# Altium schematic sheet POWER.SchDoc
size B; SheetNumber: 2; SheetTotal: 4
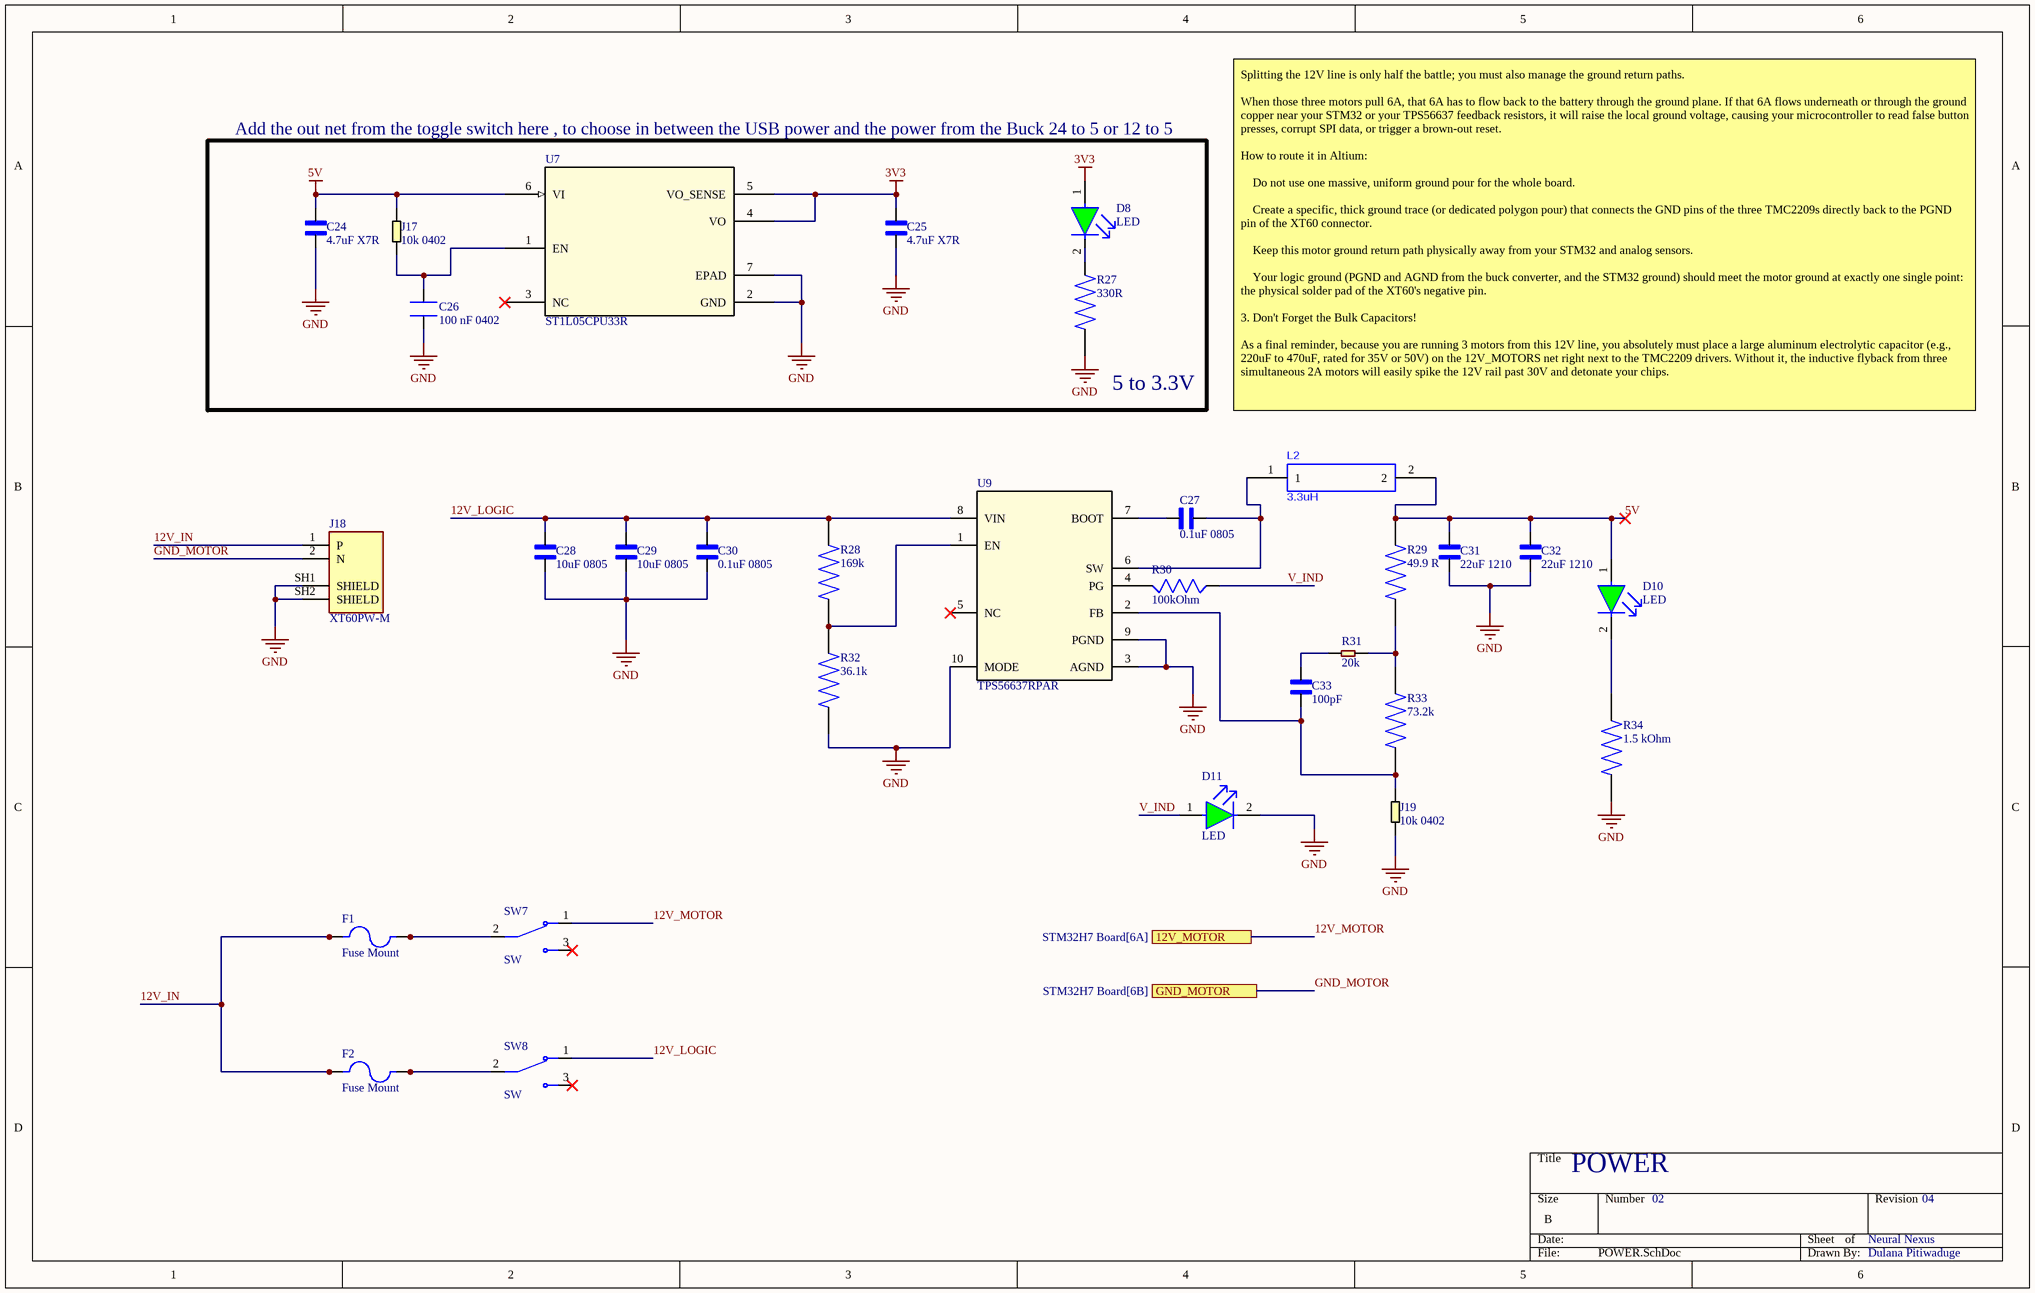
[diagram p0: POWER.SchDoc]

## Parts
C24  4.7uF X7R  [CAPC2012X145N]
C25  4.7uF X7R  [CAPC2012X145N]
C26  100 nF 0402  [CAPC1005X55N]
C27  0.1uF 0805  [CAPC2012X95N]
C28  10uF 0805  [CAPC2012X145N]
C29  10uF 0805  [CAPC2012X145N]
C30  0.1uF 0805  [CAPC2012X95N]
C31  22uF 1210  [CAPC3225X270N]
C32  22uF 1210  [CAPC3225X270N]
C33  100pF  [CAPC1005X55N]
D8  LED  [FP-SML-LX0805SRC-TR-MFG]
D10  LED  [FP-SML-LX0805SRC-TR-MFG]
D11  LED  [FP-SML-LX0805SRC-TR-MFG]
F1  Fuse Mount  [FUSE_3568]
F2  Fuse Mount  [FUSE_3568]
J17  10k 0402  [RESC1005X40N]
J18  XT60PW-M  [AMASS_XT60PW-M]
J19  10k 0402  [RESC1005X40N]
L2  3.3uH  [IND-SMD_L4.0-W4.0 - duplicate]
R27  330R  [RESC1005X40N]
R28  169k  [RESC1508X55N]
R29  49.9 R  [RESC1005X40N]
R30  100kOhm  [RESC1005X40]
R31  20k  [R0603]
R32  36.1k  [RESC1608X55N]
R33  73.2k  [RESC1005X35N]
R34  1.5 kOhm  [RESC1005X40N]
SW7  SW  [SW_100SP3T1B1M2QE]
SW8  SW  [SW_100SP3T1B1M2QE]
U7  ST1L05CPU33R  [DFN6_3X3_STM]
U9  TPS56637RPAR  [CONV_TPS56637RPAR]

## Blocks framed on the sheet
5 to 3.3V: C24-C26 D8 J17 R27 U7

## Ports
12V_MOTOR (see STM32H7 Board[6A]), GND_MOTOR (see STM32H7 Board[6B])

## Nets
3V3: C25.2 D8.1(A) U7.4(VO) U7.5(VO_SENSE)
5V: C24.2 C31.2 C32.2 D10.1(A) J17.2 L2.2 R29.2 U7.6(VI)
GND: C24.1 C25.1 C26.1 C28.1 C29.1 C30.1 C31.1 C32.1 D11.2(C) J18.SH1(SHIELD) J18.SH2(SHIELD) J19.1 R27.1 R32.1 R34.1 U7.2(GND) U7.7(EPAD) U9.3(AGND) U9.9(PGND) U9.10(MODE)
12V_IN: F1.1 F1.3 F2.1 F2.3 J18.1(P)
12V_LOGIC: C28.2 C29.2 C30.2 R28.2 SW8.1 U9.8(VIN)
12V_MOTOR: SW7.1 ; port 12V_MOTOR
GND_MOTOR: J18.2(N) ; port GND_MOTOR
V_IND: D11.1(A) R30.2
NetC26_2: C26.2 J17.1 U7.1(EN)
NetC27_1: C27.1 L2.1 U9.6(SW)
NetC27_2: C27.2 U9.7(BOOT)
NetC33_1: C33.1 J19.2 R33.1 U9.2(FB)
NetC33_2: C33.2 R31.1
NetD8_2: D8.2(C) R27.2
NetD10_2: D10.2(C) R34.2
NetF1_2: F1.2 F1.4 SW7.2
NetF2_2: F2.2 F2.4 SW8.2
NetR28_1: R28.1 R32.2 U9.1(EN)
NetR29_1: R29.1 R31.2 R33.2
NetR30_1: R30.1 U9.4(PG)

Not connected (* = marked no-connect by the designer): SW7 3*; SW8 3*; U7 3(NC)*; U9 5(NC)*

## Notes on the sheet
- Add the out net from the toggle switch here , to choose in between the USB power and the power from the Buck 24 to 5 or 12 to 5
- Splitting the 12V line is only half the battle; you must also manage the ground return paths.
  When those three motors pull 6A, that 6A has to flow back to the battery through the ground plane. If that 6A flows underneath or through the ground copper near your STM32 or your TPS56637 feedback resistors, it will raise the local ground voltage, causing your microcontroller to read false button presses, corrupt SPI data, or trigger a brown-out reset.
  How to route it in Altium:
  Do not use one massive, uniform ground pour for the whole board.
  Create a specific, thick ground trace (or dedicated polygon pour) that connects the GND pins of the three TMC2209s directly back to the PGND pin of the XT60 connector.
  Keep this motor ground return path physically away from your STM32 and analog sensors.
  Your logic ground (PGND and AGND from the buck converter, and the STM32 ground) should meet the motor ground at exactly one single point: the physical solder pad of the XT60's negative pin.
  3. Don't Forget the Bulk Capacitors!
  As a final reminder, because you are running 3 motors from this 12V line, you absolutely must place a large aluminum electrolytic capacitor (e.g., 220uF to 470uF, rated for 35V or 50V) on the 12V_MOTORS net right next to the TMC2209 drivers. Without it, the inductive flyback from three simultaneous 2A motors will easily spike the 12V rail past 30V and detonate your chips.
- POWER
- 02
- Neural Nexus
- 04
- Dulana Pitiwaduge

## Library data of the parts
C24 C25 = C2012X7R1A475K125AC: C Series 0805 4.7 uF 10 V Â±10% Tolerance X7R SMT Multilayer Ceramic Capacitor; MF: TDK; Check_prices: https://www.snapeda.com/parts/C2012X7R1A475K125AC/TDK-Lambda+Americas+Inc/view-part/?ref=eda; Purchase-URL: https://pricing.snapeda.com/search/part/C2012X7R1A475K125AC/?ref=eda; Value: *; Availability: In Stock; Price: None; Package: 2012 TDK; MP: C2012X7R1A475K125AC; SnapEDA_Link: https://www.snapeda.com/parts/C2012X7R1A475K125AC/TDK-Lambda+Americas+Inc/view-part/?ref=snap
C26 = CL05B104KP5NNNC: 0.1 ÂµF Â±10% 10V Ceramic Capacitor X7R 0402 (1005 Metric); MF: Samsung Electro-Mechanics; SnapEDA_Link: https://www.snapeda.com/parts/CL05B104KP5NNNC/Samsung/view-part/?ref=snap; Package: SMD-2 Samsung; Value: *; MP: CL05B104KP5NNNC; Check_prices: https://www.snapeda.com/parts/CL05B104KP5NNNC/Samsung/view-part/?ref=eda
C27 C30 = CL21B104KBCNNNC: 0.1 ÂµF Â±10% 50V Ceramic Capacitor X7R 0805 (2012 Metric); MF: Samsung Electro-Mechanics; SnapEDA_Link: https://www.snapeda.com/parts/CL21B104KBCNNNC/Samsung/view-part/?ref=snap; Package: SMD-2 Samsung; Value: *; MP: CL21B104KBCNNNC; Check_prices: https://www.snapeda.com/parts/CL21B104KBCNNNC/Samsung/view-part/?ref=eda
C28 C29 = GRM21BZ71E106KE15L: SMD capacitor X7R(MURATA) with capacitance 10uF Tol.10%. Rated voltage 25Vdc 125C; SnapEDA_Link: https://www.snapeda.com/parts/GRM21BZ71E106KE15L/Murata/view-part/?ref=snap; Package: 2012 Murata; Value: *; MF: Murata; MP: GRM21BZ71E106KE15L; Check_prices: https://www.snapeda.com/parts/GRM21BZ71E106KE15L/Murata/view-part/?ref=eda
C31 C32 = GRM32ER71E226KE15L: SMD capacitor X7R(EIA) with capacitance 22uF Tol.10%. Rated voltage 25Vdc 125C; MF: Murata Electronics; SnapEDA_Link: https://www.snapeda.com/parts/GRM32ER71E226KE15L/Murata+Electronics+North+America/view-part/?ref=snap; Package: 3225 Murata; Value: *; MP: GRM32ER71E226KE15L; Check_prices: https://www.snapeda.com/parts/GRM32ER71E226KE15L/Murata+Electronics+North+America/view-part/?ref=eda
C33 = CL05C101JB5NNNC: 100 pF Â±5% 50V Ceramic Capacitor C0G, NP0 0402 (1005 Metric); MF: Samsung Electro-Mechanics; SnapEDA_Link: https://www.snapeda.com/parts/CL05C101JB5NNNC/Samsung/view-part/?ref=snap; Package: SMD-2 Samsung; Value: *; MP: CL05C101JB5NNNC; Check_prices: https://www.snapeda.com/parts/CL05C101JB5NNNC/Samsung/view-part/?ref=eda
D8 D10 D11 = RED GREEN: LED RED CLEAR SMD; TRONIC part No: LE0011
F1 F2 = Fuse Mount: Auto Fuse Holder, Mini, THM, 1 Fuse, 30Amp, Hi-Temp Nylon, UL94V-0, Brass/Tin | Keystone Electronics 3568; MP: 3568; SnapEDA_Link: https://www.snapeda.com/parts/3568/Keystone/view-part/?ref=snap; Package: NON STANDARD Keystone; Value: *; MF: Keystone Electronics; Check_prices: https://www.snapeda.com/parts/3568/Keystone/view-part/?ref=eda
J17 J19 = SMD-RES-10K-5%-1/(0402): 301010004; MF: {'manufacturer': u'YAGEO'}; MP: RC0402JR-0710KL; Package: None; Price: None; Value: *; Availability: Unavailable
J18 = XT60PW-M: Socket, DC supply, male, PIN: 2; MF: AMASS; SnapEDA_Link: https://www.snapeda.com/parts/XT60PW-M/AMASS/view-part/?ref=snap; Package: Package; MP: XT60PW-M; Check_prices: https://www.snapeda.com/parts/XT60PW-M/AMASS/view-part/?ref=eda; LCSC Part Number: C98732
L2 = 33uH: FHD4020S-3R3MT; TRONIC Part No: IN0008
R27 = RC0402FR-07330RL: 330 Ohms Â±1% 0.063W, 1/16W Chip Resistor 0402 (1005 Metric) Moisture Resistant Thick Film; MF: Yageo; SnapEDA_Link: https://www.snapeda.com/parts/RC0402FR-07330RL/Yageo/view-part/?ref=snap; Package: 1005 Panasonic Electronic Components; Value: *; MP: RC0402FR-07330RL; Check_prices: https://www.snapeda.com/parts/RC0402FR-07330RL/Yageo/view-part/?ref=eda
R28 = RMCF0603FT169K: 169 kOhms Â±1% 0.1W, 1/10W Chip Resistor 0603 (1608 Metric) Automotive AEC-Q200 Thick Film; MF: Stackpole Electronics Inc; SnapEDA_Link: https://www.snapeda.com/parts/RMCF0603FT169K/Stackpole+Electronics/view-part/?ref=snap; Package: 1508 Stackpole; Value: *; MP: RMCF0603FT169K; Check_prices: https://www.snapeda.com/parts/RMCF0603FT169K/Stackpole+Electronics/view-part/?ref=eda
R29 = CRCW040249R9FKED: Resistor,Thick Film,49.9 Ohms,0.063 W,1%,SMT,0402,TCR 37 ppm/DegC,Cut Tape | Vishay Dale CRCW040249R9FKED; SnapEDA_Link: https://www.snapeda.com/parts/CRCW040249R9FKED/Vishay+Dale/view-part/?ref=snap; Package: 1005 Panasonic Electronic Components; Value: *; MF: Vishay Dale; MP: CRCW040249R9FKED; Check_prices: https://www.snapeda.com/parts/CRCW040249R9FKED/Vishay+Dale/view-part/?ref=eda
R30 = RC0402FR-07100KL: 100 kOhms Â±1% 0.063W, 1/16W Chip Resistor 0402 (1005 Metric) Moisture Resistant Thick Film; MF: Yageo; SnapEDA_Link: https://www.snapeda.com/parts/RC0402FR-07100KL/Yageo/view-part/?ref=snap; Package: 0402 Yageo; Value: *; MP: RC0402FR-07100KL; Check_prices: https://www.snapeda.com/parts/RC0402FR-07100KL/Yageo/view-part/?ref=eda
R31 = SMD-RES-20K-1%-1/10W(0603): 20 kOhms Â±1% 0.1W, 1/10W Chip Resistor 0603 (1608 Metric) Moisture Resistant Thick Film; MF: Yageo; MP: RC0603FR-0720KL; SnapEDA_Link: https://www.snapeda.com/parts/RC0603FR-0720KL/Yageo/view-part/?ref=snap; Package: 0603 Yageo; Value: *; Check_prices: https://www.snapeda.com/parts/RC0603FR-0720KL/Yageo/view-part/?ref=eda
R32 = RT0603BRD0736K1L: RES SMD 36.1KOHM 0.1% 1/10W 0603; MF: {'manufacturer': u'YAGEO'}; Package: None; Price: None; Value: *; MP: RT0603BRD0736K1L; Availability: Unavailable
R33 = RMCF0402FT73K2: RES 73.2K OHM 1% 1/16W 0402; Package: None; Price: None; Value: *; MP: RMCF0402FT73K2; Availability: Unavailable
R34 = RC0402FR-071K5L: 1.5 kOhms Â±1% 0.063W, 1/16W Chip Resistor 0402 (1005 Metric) Moisture Resistant Thick Film; MF: Yageo; SnapEDA_Link: https://www.snapeda.com/parts/RC0402FR-071K5L/Yageo/view-part/?ref=snap; Package: 1005 Panasonic Electronic Components; Value: *; MP: RC0402FR-071K5L; Check_prices: https://www.snapeda.com/parts/RC0402FR-071K5L/Yageo/view-part/?ref=eda
SW7 SW8 = 100SP3T1B1M2QE: TOGGLE, 5A, 120VAC/28VDC SPDT, On-Off-On, Panel Mount, Through Hole; MF: E-Switch; SnapEDA_Link: https://www.snapeda.com/parts/100SP3T1B1M2QE/E-Switch/view-part/?ref=snap; Package: None; Value: *; MP: 100SP3T1B1M2QE; Check_prices: https://www.snapeda.com/parts/100SP3T1B1M2QE/E-Switch/view-part/?ref=eda
U7 = ST1L05CPU33R: Very low quiescent BiCMOS voltage regulator; Manufacturer_Name: STMicroelectronics; Copyright: Copyright (C) 2026 Ultra Librarian. All rights reserved.; Manufacturer_Part_Number: ST1L05CPU33R; RefDes: RefDes; Type: Type
U9 = TPS56637RPAR: 4.5-V to 28-V, 6-A synchronous buck converter with ULQ-Mode 10-VQFN-HR -40 to 150; Manufacturer_Name: Texas Instruments; TYPE: TYPE; RefDes: RefDes; Copyright: Copyright (C) 2026 Ultra Librarian. All rights reserved.; Manufacturer_Part_Number: TPS56637RPAR